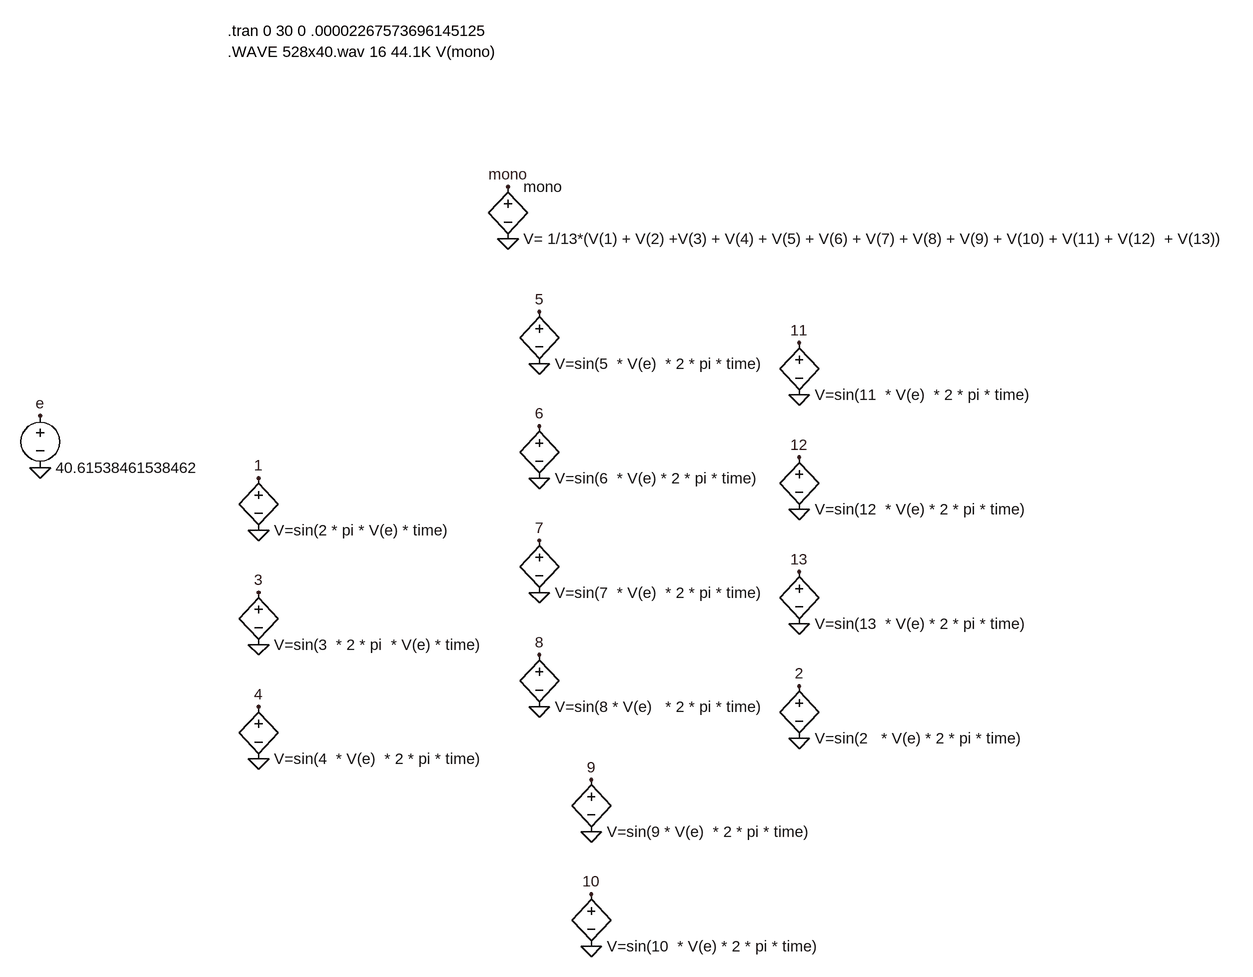
[diagram p0: schematic 528y.asc]
528y.asc, the LTspice schematic file:
Version 4
SHEET 1 2000 1924
FLAG 352 -144 1
FLAG 352 -64 0
FLAG 736 -592 mono
FLAG 736 -512 0
FLAG 352 32 3
FLAG 352 112 0
FLAG 352 208 4
FLAG 352 288 0
FLAG 784 -400 5
FLAG 784 -320 0
FLAG 784 -224 6
FLAG 784 -144 0
FLAG 784 -48 7
FLAG 784 32 0
FLAG 784 128 8
FLAG 784 208 0
FLAG 1184 -352 11
FLAG 1184 -272 0
FLAG 1184 -176 12
FLAG 1184 -96 0
FLAG 1184 0 13
FLAG 1184 80 0
FLAG 1184 176 2
FLAG 1184 256 0
FLAG 864 320 9
FLAG 864 400 0
FLAG 864 496 10
FLAG 864 576 0
FLAG 16 -160 0
FLAG 16 -240 e
SYMBOL bv 352 -160 R0
WINDOW 0 24 16 Invisible 2
SYMATTR InstName B1
SYMATTR Value V=sin(2 * pi * V(e) * time)
SYMBOL bv 736 -608 R0
SYMATTR InstName mono
SYMATTR Value V= 1/13*(V(1) + V(2) +V(3) + V(4) + V(5) + V(6) + V(7) + V(8) + V(9) + V(10) + V(11) + V(12)  + V(13))
SYMBOL bv 352 16 R0
WINDOW 0 24 16 Invisible 2
SYMATTR InstName B2
SYMATTR Value V=sin(3  * 2 * pi  * V(e) * time)
SYMBOL bv 352 192 R0
WINDOW 0 24 16 Invisible 2
SYMATTR InstName B3
SYMATTR Value V=sin(4  * V(e)  * 2 * pi * time)
SYMBOL bv 784 -416 R0
WINDOW 0 24 16 Invisible 2
SYMATTR InstName B4
SYMATTR Value V=sin(5  * V(e)  * 2 * pi * time)
SYMBOL bv 784 -240 R0
WINDOW 0 24 16 Invisible 2
SYMATTR InstName B5
SYMATTR Value V=sin(6  * V(e) * 2 * pi * time)
SYMBOL bv 784 -64 R0
WINDOW 0 24 16 Invisible 2
SYMATTR InstName B6
SYMATTR Value V=sin(7  * V(e)  * 2 * pi * time)
SYMBOL bv 784 112 R0
WINDOW 0 24 16 Invisible 2
SYMATTR InstName B7
SYMATTR Value V=sin(8 * V(e)   * 2 * pi * time)
SYMBOL bv 1184 -368 R0
WINDOW 0 24 16 Invisible 2
SYMATTR InstName B8
SYMATTR Value V=sin(11  * V(e)  * 2 * pi * time)
SYMBOL bv 1184 -192 R0
WINDOW 0 24 16 Invisible 2
SYMATTR InstName B9
SYMATTR Value V=sin(12  * V(e) * 2 * pi * time)
SYMBOL bv 1184 -16 R0
WINDOW 0 24 16 Invisible 2
SYMATTR InstName B10
SYMATTR Value V=sin(13  * V(e) * 2 * pi * time)
SYMBOL bv 1184 160 R0
WINDOW 0 24 16 Invisible 2
SYMATTR InstName B11
SYMATTR Value V=sin(2   * V(e) * 2 * pi * time)
SYMBOL bv 864 304 R0
WINDOW 0 24 16 Invisible 2
SYMATTR InstName B12
SYMATTR Value V=sin(9 * V(e)  * 2 * pi * time)
SYMBOL bv 864 480 R0
WINDOW 0 24 16 Invisible 2
SYMATTR InstName B13
SYMATTR Value V=sin(10  * V(e) * 2 * pi * time)
SYMBOL voltage 16 -256 R0
WINDOW 0 24 16 Invisible 2
SYMATTR InstName V1
SYMATTR Value 40.61538461538462
TEXT 304 -832 Left 2 !.tran 0 30 0 .00002267573696145125
TEXT 304 -800 Left 2 !.WAVE 528x40.wav 16 44.1K V(mono)

The netlist it stands for:
* 528y.asc
B1 1 0 V=sin(2 * pi * V(e) * time)
B§mono mono 0 V= 1/13*(V(1) + V(2) +V(3) + V(4) + V(5) + V(6) + V(7) + V(8) + V(9) + V(10) + V(11) + V(12)  + V(13))
B2 3 0 V=sin(3  * 2 * pi  * V(e) * time)
B3 4 0 V=sin(4  * V(e)  * 2 * pi * time)
B4 5 0 V=sin(5  * V(e)  * 2 * pi * time)
B5 6 0 V=sin(6  * V(e) * 2 * pi * time)
B6 7 0 V=sin(7  * V(e)  * 2 * pi * time)
B7 8 0 V=sin(8 * V(e)   * 2 * pi * time)
B8 11 0 V=sin(11  * V(e)  * 2 * pi * time)
B9 12 0 V=sin(12  * V(e) * 2 * pi * time)
B10 13 0 V=sin(13  * V(e) * 2 * pi * time)
B11 2 0 V=sin(2   * V(e) * 2 * pi * time)
B12 9 0 V=sin(9 * V(e)  * 2 * pi * time)
B13 10 0 V=sin(10  * V(e) * 2 * pi * time)
V1 e 0 40.61538461538462
.tran 0 30 0 .00002267573696145125
.WAVE 528x40.wav 16 44.1K V(mono)
.backanno
.end